# EAGLE design millSensorBoard (EAGLE 9.0.1)
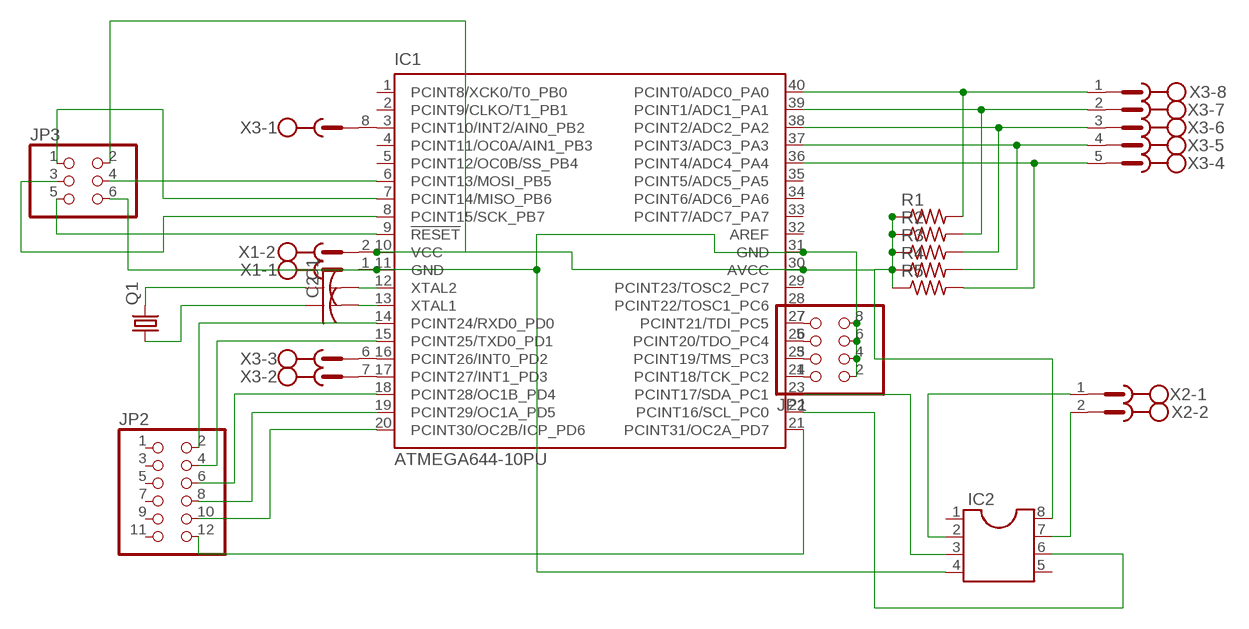
[diagram p0: schematic, sheet 1]

## Parts
C1  C-US025-025X050  [C025-025X050]
C2  C-US025-025X050  [C025-025X050]
IC1  ATMEGA644-10PU  [DIL40]
IC2  DIL8  [DIL08]
JP1  PINHD-2X4  [2X04]
JP2  PINHD-2X6  [2X06]
JP3  PINHD-2X3  [2X03]
Q1  CRYSTALHC49S  [HC49/S]
R1  R-US_0207/10  [0207/10]
R2  R-US_0207/10  [0207/10]
R3  R-US_0207/10  [0207/10]
R4  R-US_0207/10  [0207/10]
R5  R-US_0207/10  [0207/10]
X1  MSTBV2  [MSTBV2]
X2  MSTBV2  [MSTBV2]
X3  MSTBV8  [MSTBV8]

## Nets
N$1: IC1.23(PCINT17/SDA_PC1) IC2.3
N$2: IC1.22(PCINT16/SCL_PC0) IC2.6
N$3: IC1.40(PCINT0/ADC0_PA0) R1.2 X3.1
N$4: IC1.11(GND) IC1.31(GND) IC2.4 JP1.2 JP1.4 JP1.6 JP1.8 JP3.6 X1.1
N$6: IC1.39(PCINT1/ADC1_PA1) R2.2 X3.2
N$7: IC1.38(PCINT2/ADC2_PA2) R3.2 X3.3
N$8: IC1.37(PCINT3/ADC3_PA3) R4.2 X3.4
N$9: IC1.36(PCINT4/ADC4_PA4) R5.2 X3.5
N$10: IC1.17(PCINT27/INT1_PD3) X3.7
N$11: IC1.16(PCINT26/INT0_PD2) X3.6
N$12: IC1.3(PCINT10/INT2/AIN0_PB2) X3.8
N$13: IC1.14(PCINT24/RXD0_PD0) JP2.2
N$14: IC1.15(PCINT25/TXD0_PD1) JP2.4
N$15: IC1.18(PCINT28/OC1B_PD4) JP2.6
N$16: IC1.24(PCINT18/TCK_PC2) JP1.1
N$17: IC1.25(PCINT19/TMS_PC3) JP1.3
N$18: IC1.26(PCINT20/TDO_PC4) JP1.5
N$19: IC1.27(PCINT21/TDI_PC5) JP1.7
N$20: IC1.7(PCINT14/MISO_PB6) JP3.1
N$21: IC1.8(PCINT15/SCK_PB7) JP3.3
N$22: IC1.9(!RESET) JP3.5
N$23: IC1.6(PCINT13/MOSI_PB5) JP3.4
N$24: C1.2 IC1.12(XTAL2)
N$25: C2.2 IC1.13(XTAL1)
N$26: C1.1 Q1.2
N$27: C2.1 Q1.1
N$28: IC1.19(PCINT29/OC1A_PD5) JP2.8
N$29: IC2.2 X2.1
N$30: IC2.7 X2.2
N$31: IC1.20(PCINT30/OC2B/ICP_PD6) JP2.10
N$32: IC1.21(PCINT31/OC2A_PD7) JP2.12
N$33: IC1.10(VCC) IC1.30(AVCC) IC2.8 JP3.2 R1.1 R2.1 R3.1 R4.1 R5.1 X1.2
Unconnected: IC1.1(PCINT8/XCK0/T0_PB0) IC1.2(PCINT9/CLKO/T1_PB1) IC1.4(PCINT11/OC0A/AIN1_PB3) IC1.5(PCINT12/OC0B/SS_PB4) IC1.28(PCINT22/TOSC1_PC6) IC1.29(PCINT23/TOSC2_PC7) IC1.32(AREF) IC1.33(PCINT7/ADC7_PA7) IC1.34(PCINT6/ADC6_PA6) IC1.35(PCINT5/ADC5_PA5) IC2.1 IC2.5 JP2.1 JP2.3 JP2.5 JP2.7 JP2.9 JP2.11

## Library data of the parts
C1 C2 = resistor:C-US: CAPACITOR, American symbol
IC1 = atmel:ATMEGA644-*PU: 8-bit Microcontroller with 64K Bytes In-System Programmable Flash Auto generated by make-symbol-device-package-bsdl.ulp Rev. 34 Source: http://www.atmel.com/dyn/resources/prod_documents/doc2593.pdf; MPN: ATMEGA644V-10PU; OC_FARNELL: 1288342; OC_NEWARK: 23M5062
IC2 = ic-package:DIL8: Dual In Line / Socket
JP1 = pinhead:PINHD-2X4: PIN HEADER
JP2 = pinhead:PINHD-2X6: PIN HEADER
JP3 = pinhead:PINHD-2X3: PIN HEADER
Q1 = crystal:CRYSTAL: CRYSTAL; OC_FARNELL: 1667008; OC_NEWARK: unknown
R1-R5 = resistor:R-US_: RESISTOR, American symbol
X1 X2 = con-phoenix-500:MSTBV2: PHOENIX; OC_FARNELL: unknown; OC_NEWARK: unknown
X3 = con-phoenix-500:MSTBV8: PHOENIX; OC_FARNELL: unknown; OC_NEWARK: unknown

## Board
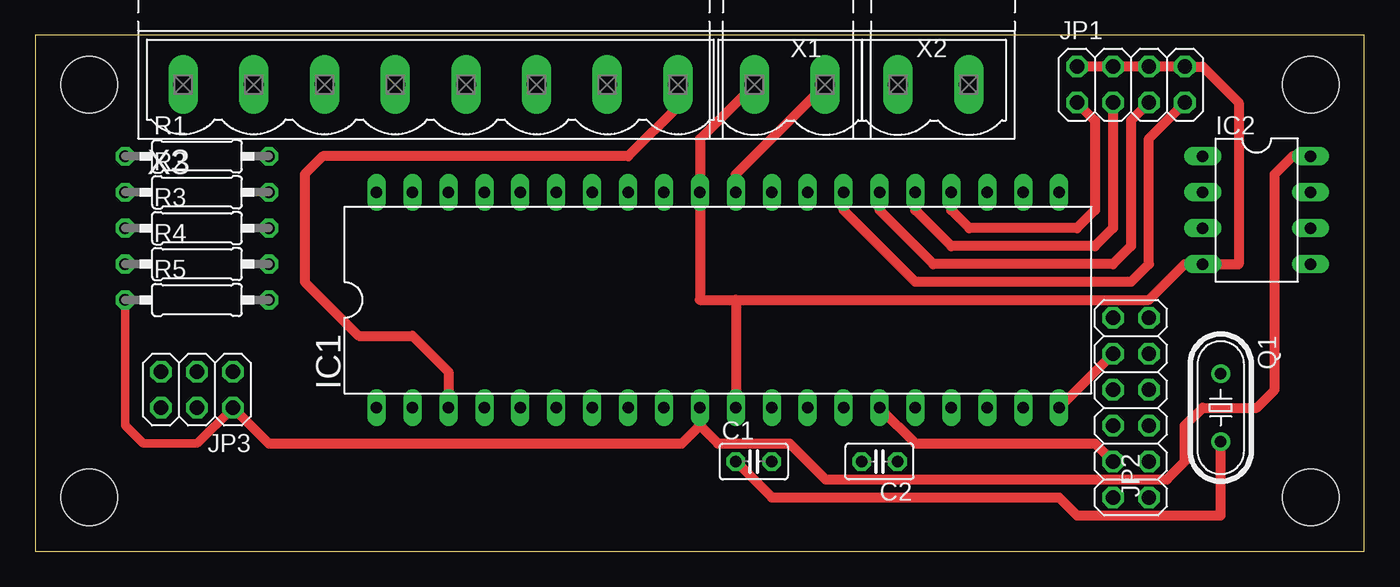
[diagram p1: board, top side]
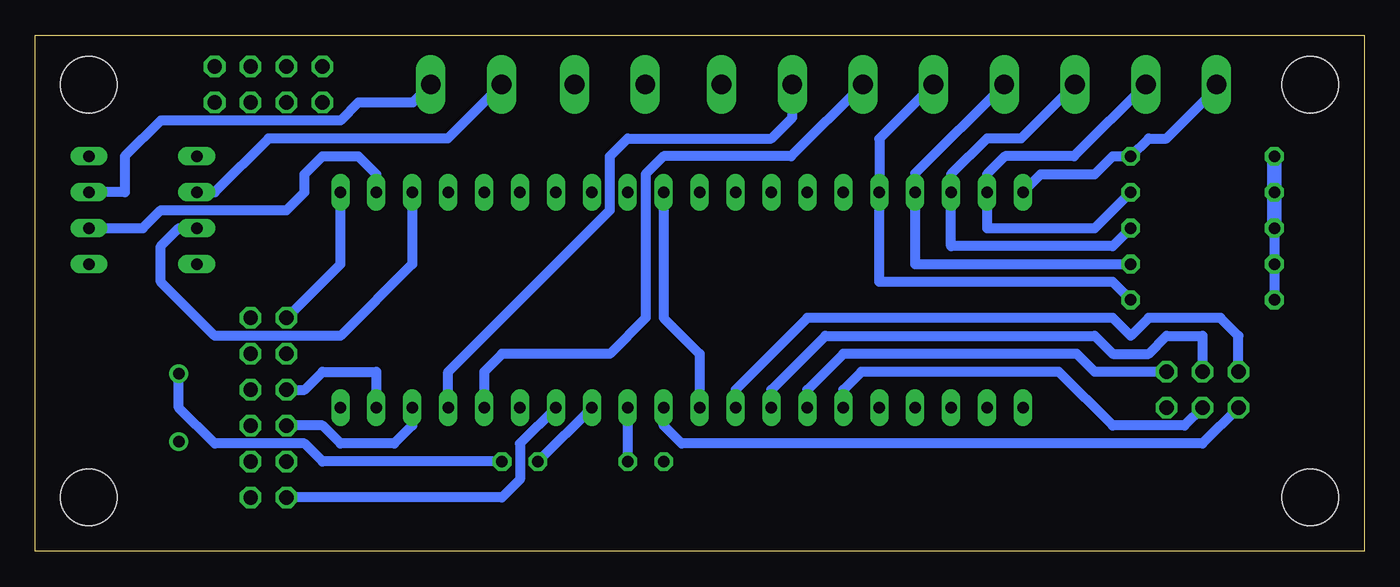
[diagram p2: board, bottom side, seen from below]

Size 93.96 x 36.5 mm. Coordinates in mm from the lower left corner, seen from the top.
Outline: 0,0 93.96,0 93.96,36.5 0,36.5 0,0
Copper layers (1*16): Top 0.035mm / dielectric 1.5mm / Bottom 0.035mm
Design rules "default": minimum track width 6mil, minimum drill 0.35mm, track to track 6mil, track to pad 6mil, pad to pad 6mil, via to via 6mil, smd to smd 6mil, copper to edge 40mil, drill to drill 6mil, minimum pad ring 10mil, minimum via ring 8mil, stop-mask expansion 4mil, vias tented up to drill 0mil, thermal gap 10mil
Holes 4 mm at 3.81,33.02 90.17,33.02 90.17,3.81 3.81,3.81

### Footprints (pad centres in the part's own frame; a part is rotated, then mirrored left to right if it is on the bottom)
C025-025X050 = drill 0.813 octagon: 1 -1.27,0; 2 1.27,0
DIL40 = drill 0.813 long: 1 -24.13,-7.62; 2 -21.59,-7.62; 3 -19.05,-7.62; 4 -16.51,-7.62; 5 -13.97,-7.62; 6 -11.43,-7.62; 7 -8.89,-7.62; 8 -6.35,-7.62; 9 -3.81,-7.62; 10 -1.27,-7.62; 11 1.27,-7.62; 12 3.81,-7.62; 13 6.35,-7.62; 14 8.89,-7.62; 15 11.43,-7.62; 16 13.97,-7.62; 17 16.51,-7.62; 18 19.05,-7.62; 19 21.59,-7.62; 20 24.13,-7.62; 21 24.13,7.62; 22 21.59,7.62; 23 19.05,7.62; 24 16.51,7.62; 25 13.97,7.62; 26 11.43,7.62; 27 8.89,7.62; 28 6.35,7.62; 29 3.81,7.62; 30 1.27,7.62; 31 -1.27,7.62; 32 -3.81,7.62; 33 -6.35,7.62; 34 -8.89,7.62; 35 -11.43,7.62; 36 -13.97,7.62; 37 -16.51,7.62; 38 -19.05,7.62; 39 -21.59,7.62; 40 -24.13,7.62
DIL08 = drill 0.813 long: 1 -3.81,-3.81; 2 -1.27,-3.81; 3 1.27,-3.81; 4 3.81,-3.81; 5 3.81,3.81; 6 1.27,3.81; 7 -1.27,3.81; 8 -3.81,3.81
2X04 = drill 1.016 octagon: 1 -3.81,-1.27; 2 -3.81,1.27; 3 -1.27,-1.27; 4 -1.27,1.27; 5 1.27,-1.27; 6 1.27,1.27; 7 3.81,-1.27; 8 3.81,1.27
2X06 = drill 1.016 octagon: 1 -6.35,-1.27; 2 -6.35,1.27; 3 -3.81,-1.27; 4 -3.81,1.27; 5 -1.27,-1.27; 6 -1.27,1.27; 7 1.27,-1.27; 8 1.27,1.27; 9 3.81,-1.27; 10 3.81,1.27; 11 6.35,-1.27; 12 6.35,1.27
2X03 = drill 1.016 octagon: 1 -2.54,-1.27; 2 -2.54,1.27; 3 0,-1.27; 4 0,1.27; 5 2.54,-1.27; 6 2.54,1.27
HC49/S = drill 0.813: 1 -2.413,0; 2 2.413,0
0207/10 = drill 0.813 octagon: 1 -5.08,0; 2 5.08,0
MSTBV2 = drill 1.397 long: 1 -2.5,0; 2 2.5,0
MSTBV8 = drill 1.397 long: 1 -17.501,0; 2 -12.497,0; 3 -7.493,0; 4 -2.489,0; 5 2.515,0; 6 7.493,0; 7 12.497,0; 8 17.501,0

### Placement (x,y rotation side)
C1  50.8,6.35 0 top
C2  59.69,6.35 180 top
IC1  48.26,17.78 0 top
IC2  86.36,24.13 270 top
JP1  77.47,33.02 0 top
JP2  77.47,10.16 90 top
JP3  11.43,11.43 180 top
Q1  83.82,10.16 270 top
R1  11.43,27.94 0 top
R2  11.43,25.4 0 top
R3  11.43,22.86 0 top
R4  11.43,20.32 0 top
R5  11.43,17.78 0 top
X1  53.34,33.02 0 top
X2  63.5,33.02 0 top
X3  27.94,33.02 0 top

### Tracks (layer width: path | path; a pad name or v marks a point on that pad's centre or on a via)
N$1
  Bottom 0.7: IC1.23 67.31,20.32 72.39,15.24 81.28,15.24 85.09,19.05 85.09,21.59 83.82,22.86 IC2.3
N$2
  Bottom 0.7: IC2.6 86.36,22.86 85.09,24.13 76.2,24.13 74.93,25.4 74.93,26.67 73.66,27.94 71.12,27.94 69.85,26.67 IC1.22
N$3
  Bottom 0.7: IC1.40 22.86,26.67 19.05,26.67 17.78,27.94 R1.2 15.24,29.21 13.97,29.21 10.44,32.74 X3.1
N$4
  Top 0.152: 76.2,34.34 JP1.4 | 78.64,34.29 78.64,34.34 JP1.6
  Top 0.7: 49.53,17.78 46.99,17.78 IC1.31 46.99,29.17 X1.1 | 49.53,17.78 IC1.11 | JP1.2 JP1.4 78.64,34.29 JP1.6 JP1.8 82.55,34.29 85.09,31.75 85.09,20.32 IC2.4 81.28,20.32 78.74,17.78 49.53,17.78
  Bottom 0.7: JP3.6 11.43,7.62 48.26,7.62 49.53,8.89 IC1.11
N$6
  Top 0.152: 15.44,31.95 15.39,32.21 15.39,32.97 X3.2
  Top 0.7: 15.24,31.75 15.44,31.95
  Bottom 0.7: X3.2 20.52,27.94 25.4,27.94 26.67,26.67 IC1.39 26.67,22.86 19.05,22.86 R2.2
N$7
  Bottom 0.7: X3.3 24.26,29.21 26.67,29.21 29.21,26.67 IC1.38 29.21,21.59 17.78,21.59 R3.2
N$8
  Bottom 0.7: X3.4 31.75,26.72 IC1.37 31.75,20.32 R4.2
N$9
  Bottom 0.7: X3.5 34.29,29.18 IC1.36 34.29,19.05 17.78,19.05 R5.2
N$10
  Bottom 0.7: IC1.17 64.77,12.7 53.34,24.13 53.34,27.94 52.07,29.21 41.91,29.21 40.44,30.68 X3.7
N$11
  Bottom 0.7: X3.6 40.51,27.94 49.53,27.94 50.8,26.67 50.8,16.51 53.34,13.97 60.96,13.97 62.23,12.7 IC1.16
N$12
  Top 0.7: X3.8 45.44,31.47 41.91,27.94 20.32,27.94 19.05,26.67 19.05,19.05 22.86,15.24 26.67,15.24 29.21,12.7 IC1.3
N$13
  Bottom 0.7: IC1.14 59.69,7.62 59.69,5.08 60.96,3.81 JP2.2
N$14
  Top 0.7: IC1.15 62.23,7.62 74.93,7.62 JP2.4
N$15
  Bottom 0.7: IC1.18 67.31,8.89 68.58,7.62 72.39,7.62 73.66,8.89 JP2.6
N$16
  Top 0.7: JP1.1 74.93,30.48 74.93,24.13 73.66,22.86 66.04,22.86 64.77,24.13 IC1.24
N$17
  Top 0.7: JP1.3 76.2,22.86 74.93,21.59 64.77,21.59 62.23,24.13 IC1.25
N$18
  Top 0.7: JP1.5 77.47,30.48 77.47,21.59 76.2,20.32 63.5,20.32 59.69,24.13 IC1.26
N$19
  Top 0.7: IC1.27 57.15,24.13 62.23,19.05 77.47,19.05 78.74,20.32 78.74,29.21 JP1.7
N$20
  Bottom 0.7: JP3.1 19.05,12.7 20.32,13.97 36.83,13.97 39.37,11.43 IC1.7
N$21
  Bottom 0.7: IC1.8 41.91,11.43 38.1,15.24 19.05,15.24 17.78,13.97 15.24,13.97 13.97,15.24 11.43,15.24 JP3.3
N$22
  Bottom 0.7: JP3.5 8.89,15.24 10.16,16.51 15.24,16.51 16.51,15.24 17.78,16.51 39.37,16.51 44.45,11.43 IC1.9
N$23
  Bottom 0.7: JP3.4 12.7,8.89 17.78,8.89 21.59,12.7 35.56,12.7 36.83,11.43 IC1.6
N$24
  Bottom 0.7: IC1.12 C1.2
N$25
  Bottom 0.7: IC1.13 C2.2
N$26
  Top 0.7: C1.1 52.07,3.81 72.39,3.81 73.66,2.54 83.82,2.54 Q1.2
N$27
  Bottom 0.7: C2.1 73.66,6.35 74.93,7.62 81.28,7.62 83.82,10.16 Q1.1
N$28
  Bottom 0.7: JP2.8 74.93,11.43 73.66,12.7 69.85,12.7 IC1.19
N$29
  Bottom 0.7: X2.1 64.81,29.21 77.47,29.21 81.28,25.4 IC2.2
N$30
  Bottom 0.7: X2.2 67.27,31.75 71.12,31.75 72.39,30.48 85.09,30.48 87.63,27.94 87.63,25.4 IC2.7
N$31
  Top 0.7: JP2.10 IC1.20
N$32
  Bottom 0.7: JP2.12 72.39,20.32 IC1.21
N$33
  Top 0.61: R5.1 6.35,8.89 7.62,7.62 11.43,7.62 JP3.2
  Top 0.7: IC1.30 49.53,26.67 55.84,32.98 X1.2 | 46.99,8.89 48.26,7.62 53.34,7.62 55.88,5.08 80.01,5.08 81.28,6.35 81.28,8.89 82.55,10.16 86.36,10.16 87.63,11.43 87.63,26.67 88.9,27.94 IC2.8 | 46.99,8.89 IC1.10 | JP3.2 16.51,7.62 45.72,7.62 46.99,8.89
  Bottom 0.7: R5.1 R4.1 R3.1 R2.1 | IC1.30 49.53,16.51 46.99,13.97 IC1.10
  Bottom 1.016: R1.1 R3.1

### Text on the board
tOrigins: Address | Analog Sensors | | | 1 | 3 | 3 | 4 | 5 | RPM | | | G | 5v | SDA | I2C | SCL | 1 | ICSP | Designed by Garrett Corbin | Freq | for Wood You Recycle | 2018